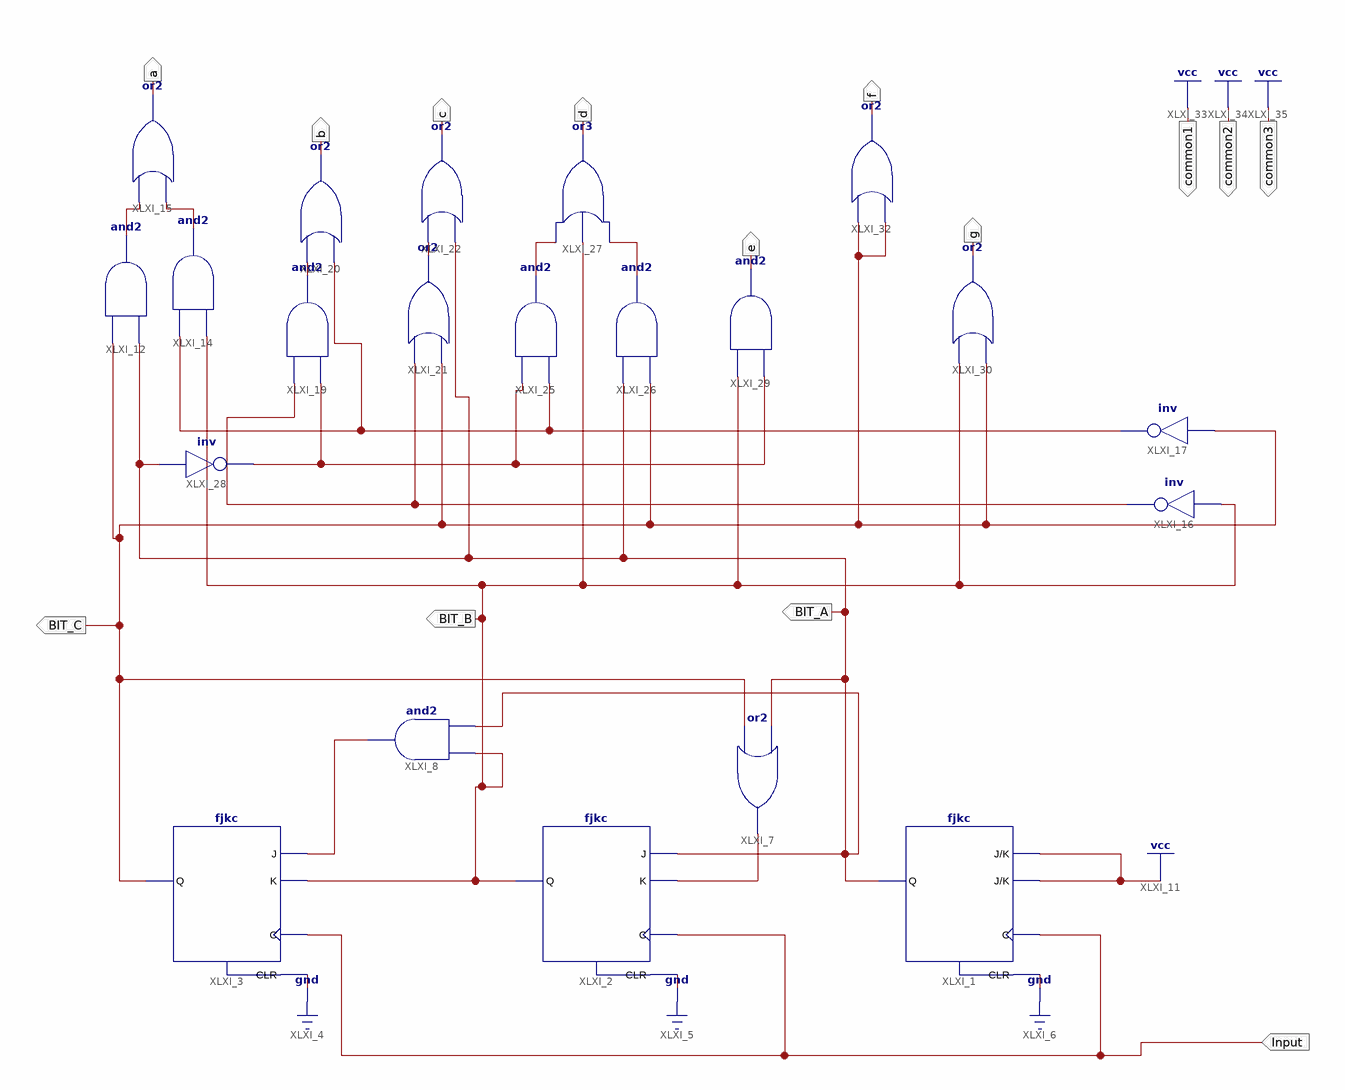
[diagram p0: schematic sheet 1]
// Xilinx ISE schematic BCD.sch (spartan6) as structural Verilog: 21 symbols, 14 ports
module BCD (
  input  Input,
  output BIT_A,
  output BIT_B,
  output BIT_C,
  output a,
  output b,
  output c,
  output d,
  output e,
  output f,
  output g,
  output common1,
  output common2,
  output common3
);

  wire XLXN_15, XLXN_18, XLXN_28, XLXN_29, XLXN_38, XLXN_39, XLXN_42, XLXN_44, XLXN_47, XLXN_48, XLXN_52;

  fjkc XLXI_1 (.C(Input), .CLR(1'b0), .J(1'b1), .K(1'b1), .Q(BIT_A));
  fjkc XLXI_2 (.C(Input), .CLR(1'b0), .J(BIT_A), .K(XLXN_15), .Q(BIT_B));
  fjkc XLXI_3 (.C(Input), .CLR(1'b0), .J(XLXN_18), .K(BIT_B), .Q(BIT_C));
  or XLXI_7 (XLXN_15, BIT_C, BIT_A);
  and XLXI_8 (XLXN_18, BIT_A, BIT_B);
  and XLXI_12 (XLXN_29, BIT_A, BIT_C);
  and XLXI_14 (XLXN_28, BIT_B, XLXN_39);
  or XLXI_15 (a, XLXN_28, XLXN_29);
  not XLXI_16 (XLXN_42, BIT_B);
  not XLXI_17 (XLXN_39, BIT_C);
  and XLXI_19 (XLXN_38, XLXN_52, XLXN_42);
  or XLXI_20 (b, XLXN_39, XLXN_38);
  or XLXI_21 (XLXN_44, BIT_C, XLXN_42);
  or XLXI_22 (c, BIT_A, XLXN_44);
  and XLXI_25 (XLXN_47, XLXN_39, XLXN_52);
  and XLXI_26 (XLXN_48, BIT_C, BIT_A);
  or XLXI_27 (d, XLXN_48, BIT_B, XLXN_47);
  not XLXI_28 (XLXN_52, BIT_A);
  and XLXI_29 (e, XLXN_52, BIT_B);
  or XLXI_30 (g, BIT_C, BIT_B);
  or XLXI_32 (f, BIT_C, BIT_C);

  assign common1 = 1'b1;
  assign common2 = 1'b1;
  assign common3 = 1'b1;

  // Notes on the sheet:
  //   CLOCK_DEDICATED_ROUTE on signal Input = TRUE
endmodule
